# EAGLE design HighVoltageMeasurementModule_1000V_multi (EAGLE 9.6.2)

## Sheet 1 of 2
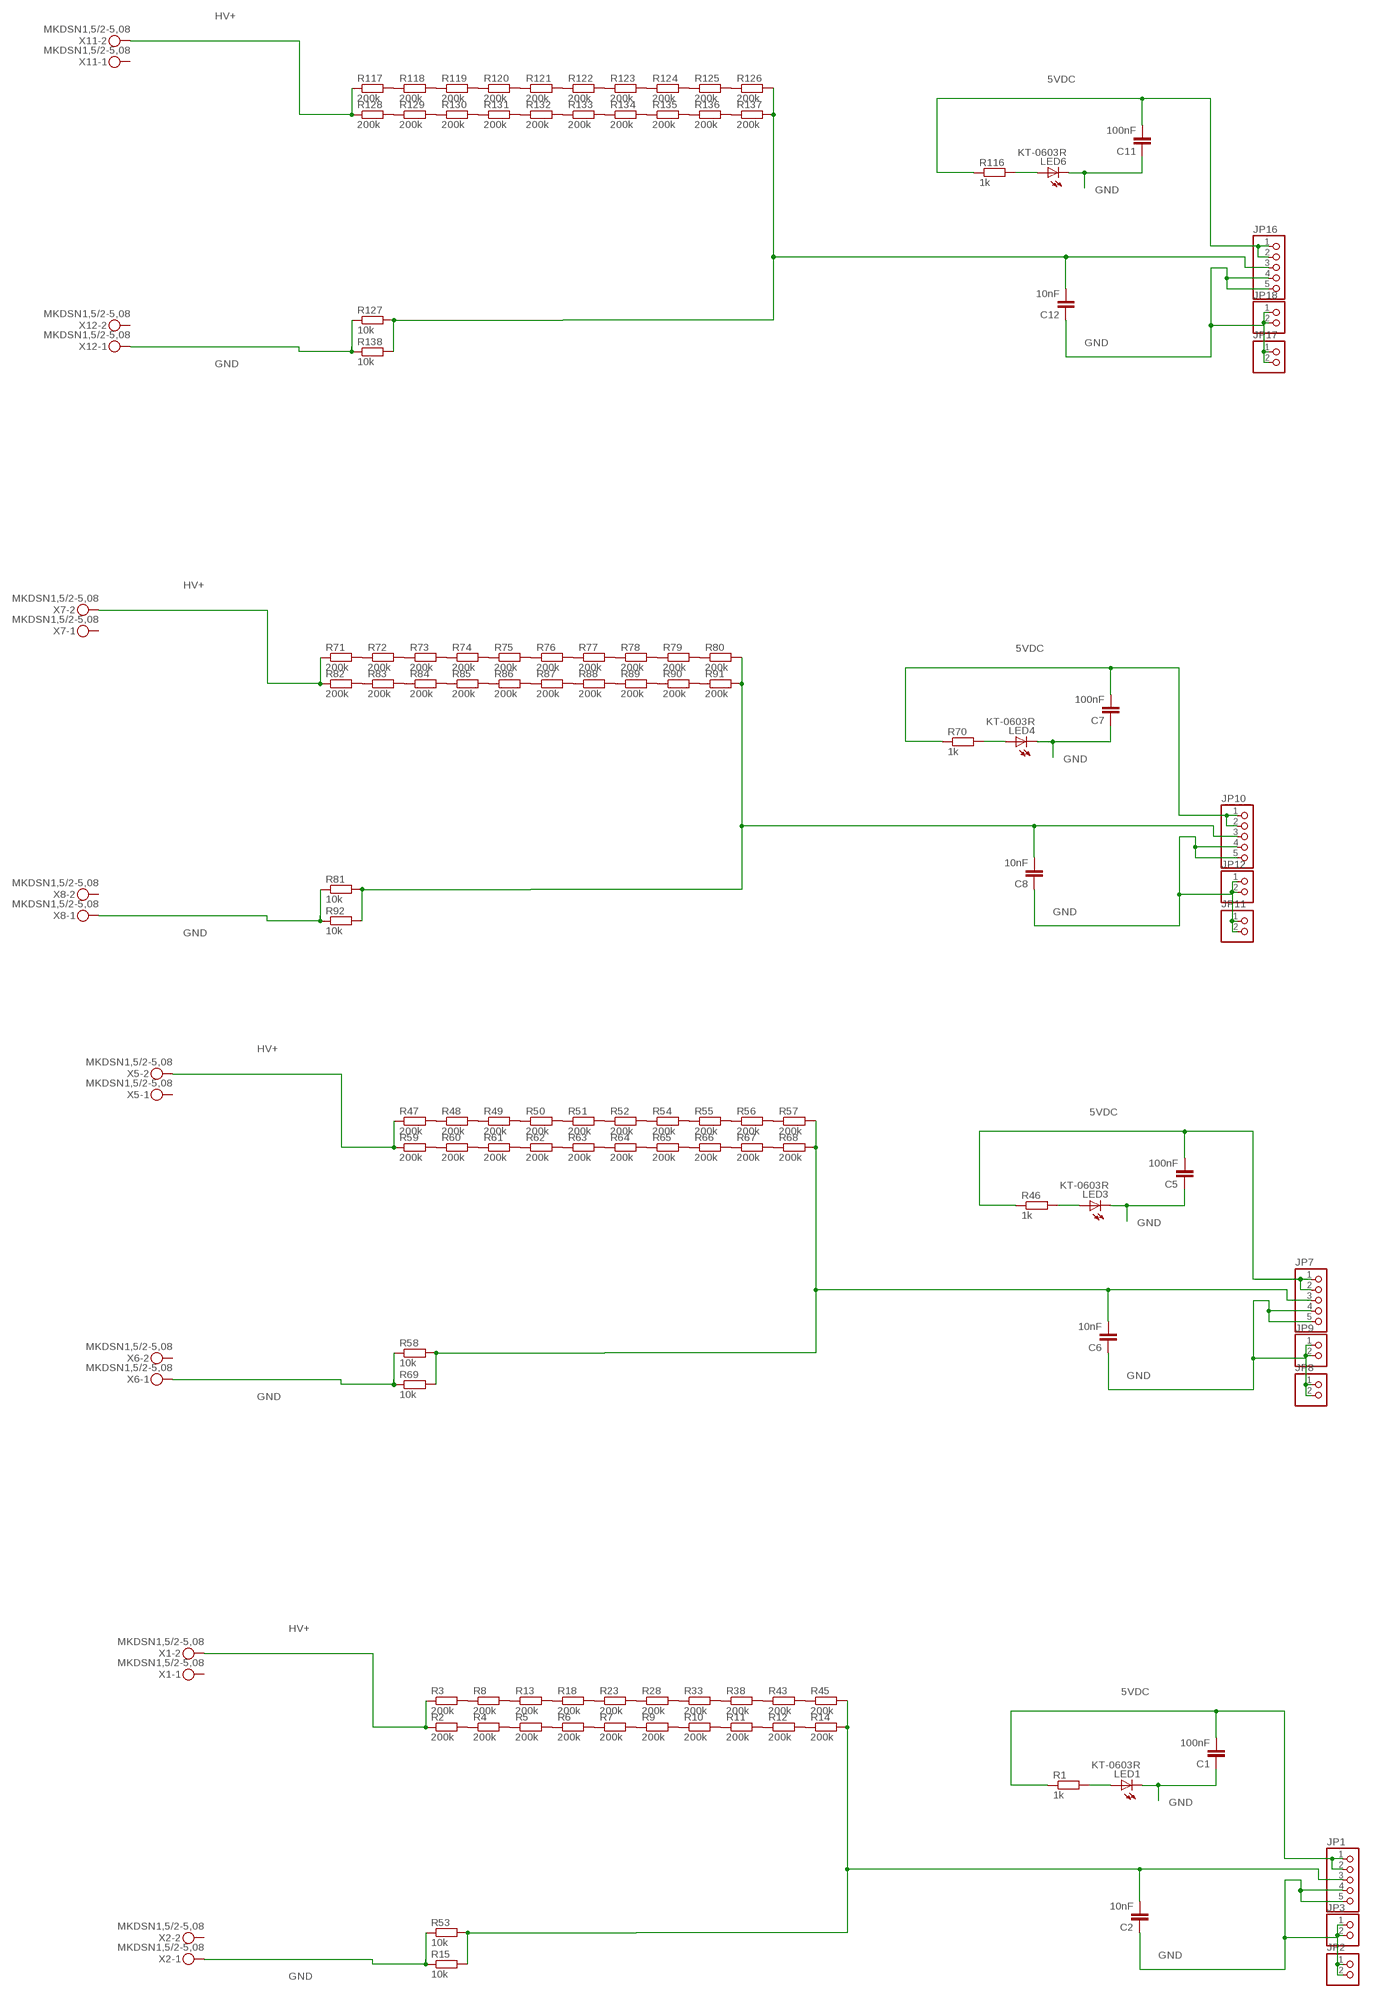
[diagram p0: schematic, sheet 1, part 1 of 2]
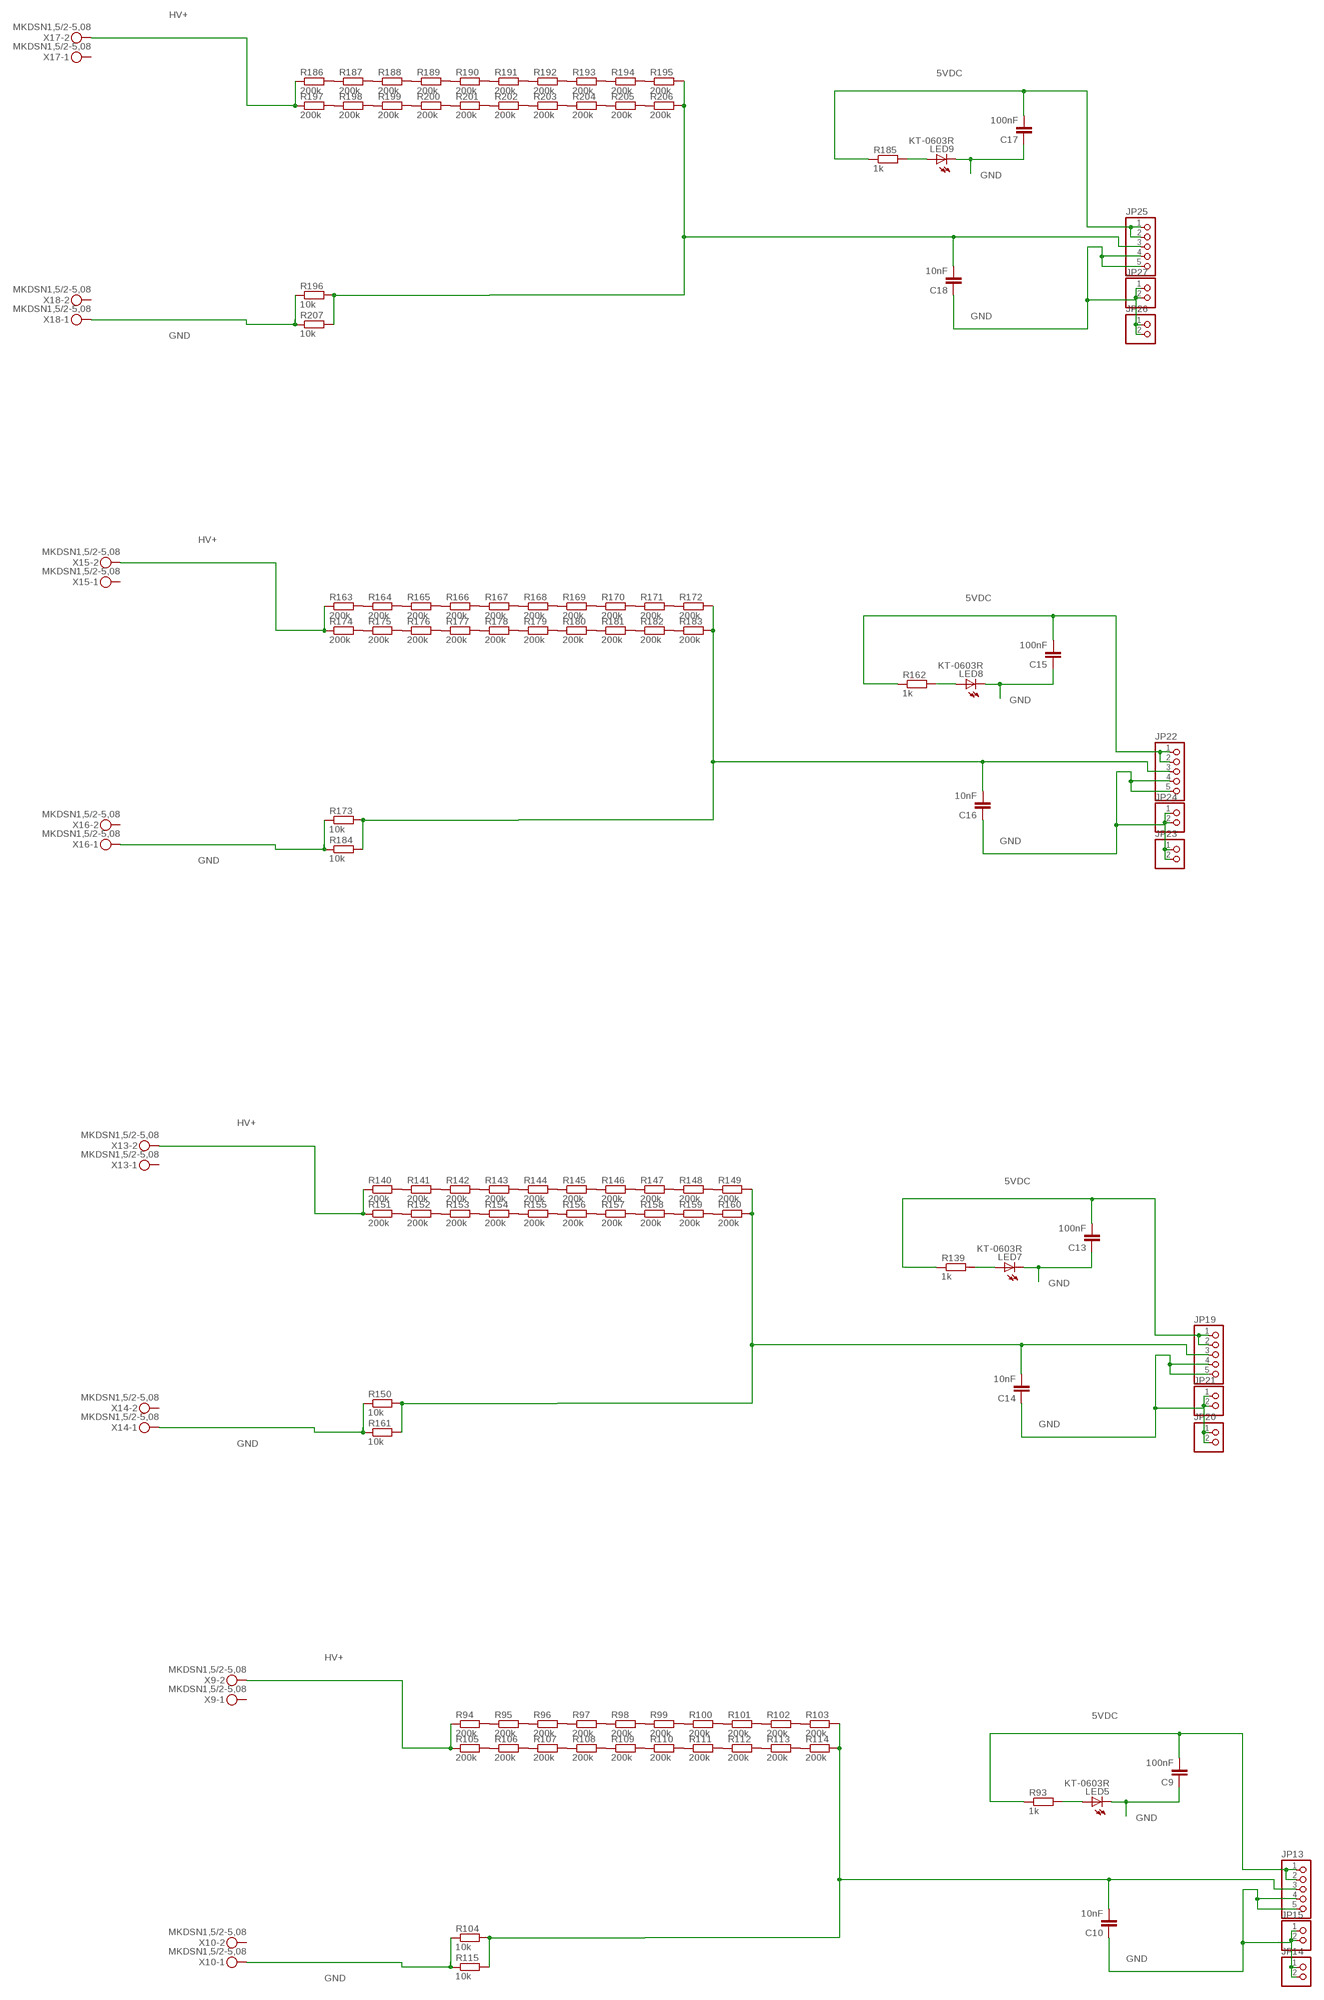
[diagram p1: schematic, sheet 1, part 2 of 2]

### Parts
C1  100nF  C-EUC0805  [C0805]
C2  10nF  C-EUC0805  [C0805]
C5  100nF  C-EUC0805  [C0805]
C6  10nF  C-EUC0805  [C0805]
C7  100nF  C-EUC0805  [C0805]
C8  10nF  C-EUC0805  [C0805]
C9  100nF  C-EUC0805  [C0805]
C10  10nF  C-EUC0805  [C0805]
C11  100nF  C-EUC0805  [C0805]
C12  10nF  C-EUC0805  [C0805]
C13  100nF  C-EUC0805  [C0805]
C14  10nF  C-EUC0805  [C0805]
C15  100nF  C-EUC0805  [C0805]
C16  10nF  C-EUC0805  [C0805]
C17  100nF  C-EUC0805  [C0805]
C18  10nF  C-EUC0805  [C0805]
JP1  PINHD-1X5  [1X05]
JP2  PINHD-1X2  [1X02]
JP3  PINHD-1X2  [1X02]
JP7  PINHD-1X5  [1X05]
JP8  PINHD-1X2  [1X02]
JP9  PINHD-1X2  [1X02]
JP10  PINHD-1X5  [1X05]
JP11  PINHD-1X2  [1X02]
JP12  PINHD-1X2  [1X02]
JP13  PINHD-1X5  [1X05]
JP14  PINHD-1X2  [1X02]
JP15  PINHD-1X2  [1X02]
JP16  PINHD-1X5  [1X05]
JP17  PINHD-1X2  [1X02]
JP18  PINHD-1X2  [1X02]
JP19  PINHD-1X5  [1X05]
JP20  PINHD-1X2  [1X02]
JP21  PINHD-1X2  [1X02]
JP22  PINHD-1X5  [1X05]
JP23  PINHD-1X2  [1X02]
JP24  PINHD-1X2  [1X02]
JP25  PINHD-1X5  [1X05]
JP26  PINHD-1X2  [1X02]
JP27  PINHD-1X2  [1X02]
LED1  KT-0603R  LEDCHIPLED_0603  [CHIPLED_0603]
LED3  KT-0603R  LEDCHIPLED_0603  [CHIPLED_0603]
LED4  KT-0603R  LEDCHIPLED_0603  [CHIPLED_0603]
LED5  KT-0603R  LEDCHIPLED_0603  [CHIPLED_0603]
LED6  KT-0603R  LEDCHIPLED_0603  [CHIPLED_0603]
LED7  KT-0603R  LEDCHIPLED_0603  [CHIPLED_0603]
LED8  KT-0603R  LEDCHIPLED_0603  [CHIPLED_0603]
LED9  KT-0603R  LEDCHIPLED_0603  [CHIPLED_0603]
R1  1k  R-EU_R0805  [R0805]
R2  200k  R-EU_R0805  [R0805]
R3  200k  R-EU_R0805  [R0805]
R4  200k  R-EU_R0805  [R0805]
R5  200k  R-EU_R0805  [R0805]
R6  200k  R-EU_R0805  [R0805]
R7  200k  R-EU_R0805  [R0805]
R8  200k  R-EU_R0805  [R0805]
R9  200k  R-EU_R0805  [R0805]
R10  200k  R-EU_R0805  [R0805]
R11  200k  R-EU_R0805  [R0805]
R12  200k  R-EU_R0805  [R0805]
R13  200k  R-EU_R0805  [R0805]
R14  200k  R-EU_R0805  [R0805]
R15  10k  R-EU_R0805  [R0805]
R18  200k  R-EU_R0805  [R0805]
R23  200k  R-EU_R0805  [R0805]
R28  200k  R-EU_R0805  [R0805]
R33  200k  R-EU_R0805  [R0805]
R38  200k  R-EU_R0805  [R0805]
R43  200k  R-EU_R0805  [R0805]
R45  200k  R-EU_R0805  [R0805]
R46  1k  R-EU_R0805  [R0805]
R47  200k  R-EU_R0805  [R0805]
R48  200k  R-EU_R0805  [R0805]
R49  200k  R-EU_R0805  [R0805]
R50  200k  R-EU_R0805  [R0805]
R51  200k  R-EU_R0805  [R0805]
R52  200k  R-EU_R0805  [R0805]
R53  10k  R-EU_R0805  [R0805]
R54  200k  R-EU_R0805  [R0805]
R55  200k  R-EU_R0805  [R0805]
R56  200k  R-EU_R0805  [R0805]
R57  200k  R-EU_R0805  [R0805]
R58  10k  R-EU_R0805  [R0805]
R59  200k  R-EU_R0805  [R0805]
R60  200k  R-EU_R0805  [R0805]
R61  200k  R-EU_R0805  [R0805]
R62  200k  R-EU_R0805  [R0805]
R63  200k  R-EU_R0805  [R0805]
R64  200k  R-EU_R0805  [R0805]
R65  200k  R-EU_R0805  [R0805]
R66  200k  R-EU_R0805  [R0805]
R67  200k  R-EU_R0805  [R0805]
R68  200k  R-EU_R0805  [R0805]
R69  10k  R-EU_R0805  [R0805]
R70  1k  R-EU_R0805  [R0805]
R71  200k  R-EU_R0805  [R0805]
R72  200k  R-EU_R0805  [R0805]
R73  200k  R-EU_R0805  [R0805]
R74  200k  R-EU_R0805  [R0805]
R75  200k  R-EU_R0805  [R0805]
R76  200k  R-EU_R0805  [R0805]
R77  200k  R-EU_R0805  [R0805]
R78  200k  R-EU_R0805  [R0805]
R79  200k  R-EU_R0805  [R0805]
R80  200k  R-EU_R0805  [R0805]
R81  10k  R-EU_R0805  [R0805]
R82  200k  R-EU_R0805  [R0805]
R83  200k  R-EU_R0805  [R0805]
R84  200k  R-EU_R0805  [R0805]
R85  200k  R-EU_R0805  [R0805]
R86  200k  R-EU_R0805  [R0805]
R87  200k  R-EU_R0805  [R0805]
R88  200k  R-EU_R0805  [R0805]
R89  200k  R-EU_R0805  [R0805]
R90  200k  R-EU_R0805  [R0805]
R91  200k  R-EU_R0805  [R0805]
R92  10k  R-EU_R0805  [R0805]
R93  1k  R-EU_R0805  [R0805]
R94  200k  R-EU_R0805  [R0805]
R95  200k  R-EU_R0805  [R0805]
R96  200k  R-EU_R0805  [R0805]
R97  200k  R-EU_R0805  [R0805]
R98  200k  R-EU_R0805  [R0805]
R99  200k  R-EU_R0805  [R0805]
R100  200k  R-EU_R0805  [R0805]
R101  200k  R-EU_R0805  [R0805]
R102  200k  R-EU_R0805  [R0805]
R103  200k  R-EU_R0805  [R0805]
R104  10k  R-EU_R0805  [R0805]
R105  200k  R-EU_R0805  [R0805]
R106  200k  R-EU_R0805  [R0805]
R107  200k  R-EU_R0805  [R0805]
R108  200k  R-EU_R0805  [R0805]
R109  200k  R-EU_R0805  [R0805]
R110  200k  R-EU_R0805  [R0805]
R111  200k  R-EU_R0805  [R0805]
R112  200k  R-EU_R0805  [R0805]
R113  200k  R-EU_R0805  [R0805]
R114  200k  R-EU_R0805  [R0805]
R115  10k  R-EU_R0805  [R0805]
R116  1k  R-EU_R0805  [R0805]
R117  200k  R-EU_R0805  [R0805]
R118  200k  R-EU_R0805  [R0805]
R119  200k  R-EU_R0805  [R0805]
R120  200k  R-EU_R0805  [R0805]
R121  200k  R-EU_R0805  [R0805]
R122  200k  R-EU_R0805  [R0805]
R123  200k  R-EU_R0805  [R0805]
R124  200k  R-EU_R0805  [R0805]
R125  200k  R-EU_R0805  [R0805]
R126  200k  R-EU_R0805  [R0805]
R127  10k  R-EU_R0805  [R0805]
R128  200k  R-EU_R0805  [R0805]
R129  200k  R-EU_R0805  [R0805]
R130  200k  R-EU_R0805  [R0805]
R131  200k  R-EU_R0805  [R0805]
R132  200k  R-EU_R0805  [R0805]
R133  200k  R-EU_R0805  [R0805]
R134  200k  R-EU_R0805  [R0805]
R135  200k  R-EU_R0805  [R0805]
R136  200k  R-EU_R0805  [R0805]
R137  200k  R-EU_R0805  [R0805]
R138  10k  R-EU_R0805  [R0805]
R139  1k  R-EU_R0805  [R0805]
R140  200k  R-EU_R0805  [R0805]
R141  200k  R-EU_R0805  [R0805]
R142  200k  R-EU_R0805  [R0805]
R143  200k  R-EU_R0805  [R0805]
R144  200k  R-EU_R0805  [R0805]
R145  200k  R-EU_R0805  [R0805]
R146  200k  R-EU_R0805  [R0805]
R147  200k  R-EU_R0805  [R0805]
R148  200k  R-EU_R0805  [R0805]
R149  200k  R-EU_R0805  [R0805]
R150  10k  R-EU_R0805  [R0805]
R151  200k  R-EU_R0805  [R0805]
R152  200k  R-EU_R0805  [R0805]
R153  200k  R-EU_R0805  [R0805]
R154  200k  R-EU_R0805  [R0805]
R155  200k  R-EU_R0805  [R0805]
R156  200k  R-EU_R0805  [R0805]
R157  200k  R-EU_R0805  [R0805]
R158  200k  R-EU_R0805  [R0805]
R159  200k  R-EU_R0805  [R0805]
R160  200k  R-EU_R0805  [R0805]
R161  10k  R-EU_R0805  [R0805]
R162  1k  R-EU_R0805  [R0805]
R163  200k  R-EU_R0805  [R0805]
R164  200k  R-EU_R0805  [R0805]
R165  200k  R-EU_R0805  [R0805]
R166  200k  R-EU_R0805  [R0805]
R167  200k  R-EU_R0805  [R0805]
R168  200k  R-EU_R0805  [R0805]
R169  200k  R-EU_R0805  [R0805]
R170  200k  R-EU_R0805  [R0805]
R171  200k  R-EU_R0805  [R0805]
R172  200k  R-EU_R0805  [R0805]
R173  10k  R-EU_R0805  [R0805]
R174  200k  R-EU_R0805  [R0805]
R175  200k  R-EU_R0805  [R0805]
R176  200k  R-EU_R0805  [R0805]
R177  200k  R-EU_R0805  [R0805]
R178  200k  R-EU_R0805  [R0805]
R179  200k  R-EU_R0805  [R0805]
R180  200k  R-EU_R0805  [R0805]
R181  200k  R-EU_R0805  [R0805]
R182  200k  R-EU_R0805  [R0805]
R183  200k  R-EU_R0805  [R0805]
R184  10k  R-EU_R0805  [R0805]
R185  1k  R-EU_R0805  [R0805]
R186  200k  R-EU_R0805  [R0805]
R187  200k  R-EU_R0805  [R0805]
R188  200k  R-EU_R0805  [R0805]
R189  200k  R-EU_R0805  [R0805]
R190  200k  R-EU_R0805  [R0805]
R191  200k  R-EU_R0805  [R0805]
R192  200k  R-EU_R0805  [R0805]
R193  200k  R-EU_R0805  [R0805]
R194  200k  R-EU_R0805  [R0805]
R195  200k  R-EU_R0805  [R0805]
R196  10k  R-EU_R0805  [R0805]
R197  200k  R-EU_R0805  [R0805]
R198  200k  R-EU_R0805  [R0805]
R199  200k  R-EU_R0805  [R0805]
R200  200k  R-EU_R0805  [R0805]
R201  200k  R-EU_R0805  [R0805]
R202  200k  R-EU_R0805  [R0805]
R203  200k  R-EU_R0805  [R0805]
R204  200k  R-EU_R0805  [R0805]
R205  200k  R-EU_R0805  [R0805]
R206  200k  R-EU_R0805  [R0805]
R207  10k  R-EU_R0805  [R0805]
X1  MKDSN1,5/2-5,08  [MKDSN1,5/2-5,08]
X2  MKDSN1,5/2-5,08  [MKDSN1,5/2-5,08]
X5  MKDSN1,5/2-5,08  [MKDSN1,5/2-5,08]
X6  MKDSN1,5/2-5,08  [MKDSN1,5/2-5,08]
X7  MKDSN1,5/2-5,08  [MKDSN1,5/2-5,08]
X8  MKDSN1,5/2-5,08  [MKDSN1,5/2-5,08]
X9  MKDSN1,5/2-5,08  [MKDSN1,5/2-5,08]
X10  MKDSN1,5/2-5,08  [MKDSN1,5/2-5,08]
X11  MKDSN1,5/2-5,08  [MKDSN1,5/2-5,08]
X12  MKDSN1,5/2-5,08  [MKDSN1,5/2-5,08]
X13  MKDSN1,5/2-5,08  [MKDSN1,5/2-5,08]
X14  MKDSN1,5/2-5,08  [MKDSN1,5/2-5,08]
X15  MKDSN1,5/2-5,08  [MKDSN1,5/2-5,08]
X16  MKDSN1,5/2-5,08  [MKDSN1,5/2-5,08]
X17  MKDSN1,5/2-5,08  [MKDSN1,5/2-5,08]
X18  MKDSN1,5/2-5,08  [MKDSN1,5/2-5,08]

### Nets
5VDC: C1.2 C5.2 C7.2 C9.2 C11.2 C13.2 C15.2 C17.2 JP1.1 JP1.2 JP7.1 JP7.2 JP10.1 JP10.2 JP13.1 JP13.2 JP16.1 JP16.2 JP19.1 JP19.2 JP22.1 JP22.2 JP25.1 JP25.2 R1.1 R46.1 R70.1 R93.1 R116.1 R139.1 R162.1 R185.1
GND: C1.1 C2.1 C5.1 C6.1 C7.1 C8.1 C9.1 C10.1 C11.1 C12.1 C13.1 C14.1 C15.1 C16.1 C17.1 C18.1 JP1.4 JP1.5 JP2.1 JP2.2 JP3.1 JP3.2 JP7.4 JP7.5 JP8.1 JP8.2 JP9.1 JP9.2 JP10.4 JP10.5 JP11.1 JP11.2 JP12.1 JP12.2 JP13.4 JP13.5 JP14.1 JP14.2 JP15.1 JP15.2 JP16.4 JP16.5 JP17.1 JP17.2 JP18.1 JP18.2 JP19.4 JP19.5 JP20.1 JP20.2 JP21.1 JP21.2 JP22.4 JP22.5 JP23.1 JP23.2 JP24.1 JP24.2 JP25.4 JP25.5 JP26.1 JP26.2 JP27.1 JP27.2 LED1.C LED3.C LED4.C LED5.C LED6.C LED7.C LED8.C LED9.C R15.1 R53.1 R58.1 R69.1 R81.1 R92.1 R104.1 R115.1 R127.1 R138.1 R150.1 R161.1 R173.1 R184.1 R196.1 R207.1 X2.1 X6.1 X8.1 X10.1 X12.1 X14.1 X16.1 X18.1
HV+: R2.1 R3.1 R47.1 R59.1 R71.1 R82.1 R94.1 R105.1 R117.1 R128.1 R140.1 R151.1 R163.1 R174.1 R186.1 R197.1 X1.2 X5.2 X7.2 X9.2 X11.2 X13.2 X15.2 X17.2
N$1: R2.2 R4.1
N$2: R4.2 R5.1
N$3: R5.2 R6.1
N$4: R6.2 R7.1
N$5: LED1.A R1.2
N$7: R7.2 R9.1
N$8: R3.2 R8.1
N$9: R8.2 R13.1
N$10: R9.2 R10.1
N$11: R10.2 R11.1
N$12: R11.2 R12.1
N$13: R12.2 R14.1
N$14: R13.2 R18.1
N$15: C2.2 JP1.3 R14.2 R15.2 R45.2 R53.2
N$19: R18.2 R23.1
N$24: R23.2 R28.1
N$29: R28.2 R33.1
N$34: R33.2 R38.1
N$39: R38.2 R43.1
N$40: LED3.A R46.2
N$41: R43.2 R45.1
N$42: R47.2 R48.1
N$43: R48.2 R49.1
N$44: R49.2 R50.1
N$45: R50.2 R51.1
N$46: R51.2 R52.1
N$47: R52.2 R54.1
N$48: R54.2 R55.1
N$49: R55.2 R56.1
N$50: R56.2 R57.1
N$51: R59.2 R60.1
N$52: R60.2 R61.1
N$53: R61.2 R62.1
N$54: R62.2 R63.1
N$55: R63.2 R64.1
N$56: R64.2 R65.1
N$57: R65.2 R66.1
N$58: R66.2 R67.1
N$59: R67.2 R68.1
N$60: C6.2 JP7.3 R57.2 R58.2 R68.2 R69.2
N$61: LED4.A R70.2
N$62: R71.2 R72.1
N$63: R72.2 R73.1
N$64: R73.2 R74.1
N$65: R74.2 R75.1
N$66: R75.2 R76.1
N$67: R76.2 R77.1
N$68: R77.2 R78.1
N$69: R78.2 R79.1
N$70: R79.2 R80.1
N$71: R82.2 R83.1
N$72: R83.2 R84.1
N$73: R84.2 R85.1
N$74: R85.2 R86.1
N$75: R86.2 R87.1
N$76: R87.2 R88.1
N$77: R88.2 R89.1
N$78: R89.2 R90.1
N$79: R90.2 R91.1
N$80: C8.2 JP10.3 R80.2 R81.2 R91.2 R92.2
N$81: LED5.A R93.2
N$82: R94.2 R95.1
N$83: R95.2 R96.1
N$84: R96.2 R97.1
N$85: R97.2 R98.1
N$86: R98.2 R99.1
N$87: R99.2 R100.1
N$88: R100.2 R101.1
N$89: R101.2 R102.1
N$90: R102.2 R103.1
N$91: R105.2 R106.1
N$92: R106.2 R107.1
N$93: R107.2 R108.1
N$94: R108.2 R109.1
N$95: R109.2 R110.1
N$96: R110.2 R111.1
N$97: R111.2 R112.1
N$98: R112.2 R113.1
N$99: R113.2 R114.1
N$100: C10.2 JP13.3 R103.2 R104.2 R114.2 R115.2
N$101: LED6.A R116.2
N$102: R117.2 R118.1
N$103: R118.2 R119.1
N$104: R119.2 R120.1
N$105: R120.2 R121.1
N$106: R121.2 R122.1
N$107: R122.2 R123.1
N$108: R123.2 R124.1
N$109: R124.2 R125.1
N$110: R125.2 R126.1
N$111: R128.2 R129.1
N$112: R129.2 R130.1
N$113: R130.2 R131.1
N$114: R131.2 R132.1
N$115: R132.2 R133.1
N$116: R133.2 R134.1
N$117: R134.2 R135.1
N$118: R135.2 R136.1
N$119: R136.2 R137.1
N$120: C12.2 JP16.3 R126.2 R127.2 R137.2 R138.2
N$121: LED7.A R139.2
N$122: R140.2 R141.1
N$123: R141.2 R142.1
N$124: R142.2 R143.1
N$125: R143.2 R144.1
N$126: R144.2 R145.1
N$127: R145.2 R146.1
N$128: R146.2 R147.1
N$129: R147.2 R148.1
N$130: R148.2 R149.1
N$131: R151.2 R152.1
N$132: R152.2 R153.1
N$133: R153.2 R154.1
N$134: R154.2 R155.1
N$135: R155.2 R156.1
N$136: R156.2 R157.1
N$137: R157.2 R158.1
N$138: R158.2 R159.1
N$139: R159.2 R160.1
N$140: C14.2 JP19.3 R149.2 R150.2 R160.2 R161.2
N$141: LED8.A R162.2
N$142: R163.2 R164.1
N$143: R164.2 R165.1
N$144: R165.2 R166.1
N$145: R166.2 R167.1
N$146: R167.2 R168.1
N$147: R168.2 R169.1
N$148: R169.2 R170.1
N$149: R170.2 R171.1
N$150: R171.2 R172.1
N$151: R174.2 R175.1
N$152: R175.2 R176.1
N$153: R176.2 R177.1
N$154: R177.2 R178.1
N$155: R178.2 R179.1
N$156: R179.2 R180.1
N$157: R180.2 R181.1
N$158: R181.2 R182.1
N$159: R182.2 R183.1
N$160: C16.2 JP22.3 R172.2 R173.2 R183.2 R184.2
N$161: LED9.A R185.2
N$162: R186.2 R187.1
N$163: R187.2 R188.1
N$164: R188.2 R189.1
N$165: R189.2 R190.1
N$166: R190.2 R191.1
N$167: R191.2 R192.1
N$168: R192.2 R193.1
N$169: R193.2 R194.1
N$170: R194.2 R195.1
N$171: R197.2 R198.1
N$172: R198.2 R199.1
N$173: R199.2 R200.1
N$174: R200.2 R201.1
N$175: R201.2 R202.1
N$176: R202.2 R203.1
N$177: R203.2 R204.1
N$178: R204.2 R205.1
N$179: R205.2 R206.1
N$180: C18.2 JP25.3 R195.2 R196.2 R206.2 R207.2
Unconnected: X1.1 X2.2 X5.1 X6.2 X7.1 X8.2 X9.1 X10.2 X11.1 X12.2 X13.1 X14.2 X15.1 X16.2 X17.1 X18.2

## Sheet 2 of 2

## Library data of the parts
C1 C2 C5-C18 = rcl:C-EU: CAPACITOR, European symbol
JP1 JP7 JP10 JP13 JP16 JP19 JP22 JP25 = pinhead:PINHD-1X5: PIN HEADER
JP2 JP3 JP8 JP9 JP11 JP12 JP14 JP15 JP17 JP18 JP20 JP21 JP23 JP24 JP26 JP27 = pinhead:PINHD-1X2: PIN HEADER
LED1 LED3-LED9 = led:LED: LED OSRAM: - CHIPLED LG R971, LG N971, LY N971, LG Q971, LY Q971, LO R971, LY R971 LH N974, LH R974 LS Q976, LO Q976, LY Q976 LO Q996 - Hyper CHIPLED LW Q18S LB Q993, LB Q99A, LB R99A - SideLED LS A670, LO A670, LY A670, LG A670, LP A670 LB A673, LV A673, LT A673, LW A673 LH A674 LY A675 LS A676, LA A676, LO A676, LY A676, LW A676 LS A679, LY A679, LG A679 - Hyper Micro SIDELED® LS Y876, LA Y876, LO Y876, LY Y876 LT Y87S - SmartLED LW L88C, LW L88S LB L89C, LB L89S, LG L890 LS L89K, LO L89K, LY L89K LS L896, LA L896, LO L896, LY L896 - TOPLED LS T670, LO T670, LY T670, LG T670, LP T670 LSG T670, LSP T670, LSY T670, LOP T670, LYG T670 LG T671, LOG T671, LSG T671 LB T673, LV T673, LT T673, LW T673 LH T674 LS T676, LA T676, LO T676, LY T676, LB T676, LH T676, LSB T676, LW T676 LB T67C, LV T67C, LT T67C, LS T67K, LO T67K, LY T67K, LW E67C LS E67B, LA E67B, LO E67B, LY E67B, LB E67C, LV E67C, LT E67C LW T67C LS T679, LY T679, LG T679 LS T770, LO T770, LY T770, LG T770, LP T770 LB T773, LV T773, LT T773, LW T773 LH T774 LS E675, LA E675, LY E675, LS T675 LS T776, LA T776, LO T776, LY T776, LB T776 LHGB T686 LT T68C, LB T68C - Hyper Mini TOPLED® LB M676 - Mini TOPLED Santana® LG M470 LS M47K, LO M47K, LY M47K Source: http://www.osram.convergy.de LUXEON: - LUMILED® LXK2-PW12-R00, LXK2-PW12-S00, LXK2-PW14-U00, LXK2-PW14-V00 LXK2-PM12-R00, LXK2-PM12-S00, LXK2-PM14-U00 LXK2-PE12-Q00, LXK2-PE12-R00, LXK2-PE12-S00, LXK2-PE14-T00, LXK2-PE14-U00 LXK2-PB12-K00, LXK2-PB12-L00, LXK2-PB12-M00, LXK2-PB14-N00, LXK2-PB14-P00, LXK2-PB14-Q00 LXK2-PR12-L00, LXK2-PR12-M00, LXK2-PR14-Q00, LXK2-PR14-R00 LXK2-PD12-Q00, LXK2-PD12-R00, LXK2-PD12-S00 LXK2-PH12-R00, LXK2-PH12-S00 LXK2-PL12-P00, LXK2-PL12-Q00, LXK2-PL12-R00 Source: www.luxeon.com KINGBRIGHT: KA-3528ASYC Source: www.kingbright.com
R1-R15 R18 R23 R28 R33 R38 R43 R45-R207 = rcl:R-EU_: RESISTOR, European symbol
X1 X2 X5-X18 = con-phoenix-508:MKDSN1,5/2-5,08: MKDSN 1,5/ 2-5,08 Printklemme Nennstrom: 13,5 A Nennspannung: 250 V Rastermaß: 5,08 mm Polzahl: 2 Anschlussart: Schraubanschluss Montage: Löten Anschlussrichtung Leiter/Platine: 0 ° Artikelnummer: 1729128 Source: http://eshop.phoenixcontact.com .. 1729128.pdf

## Board
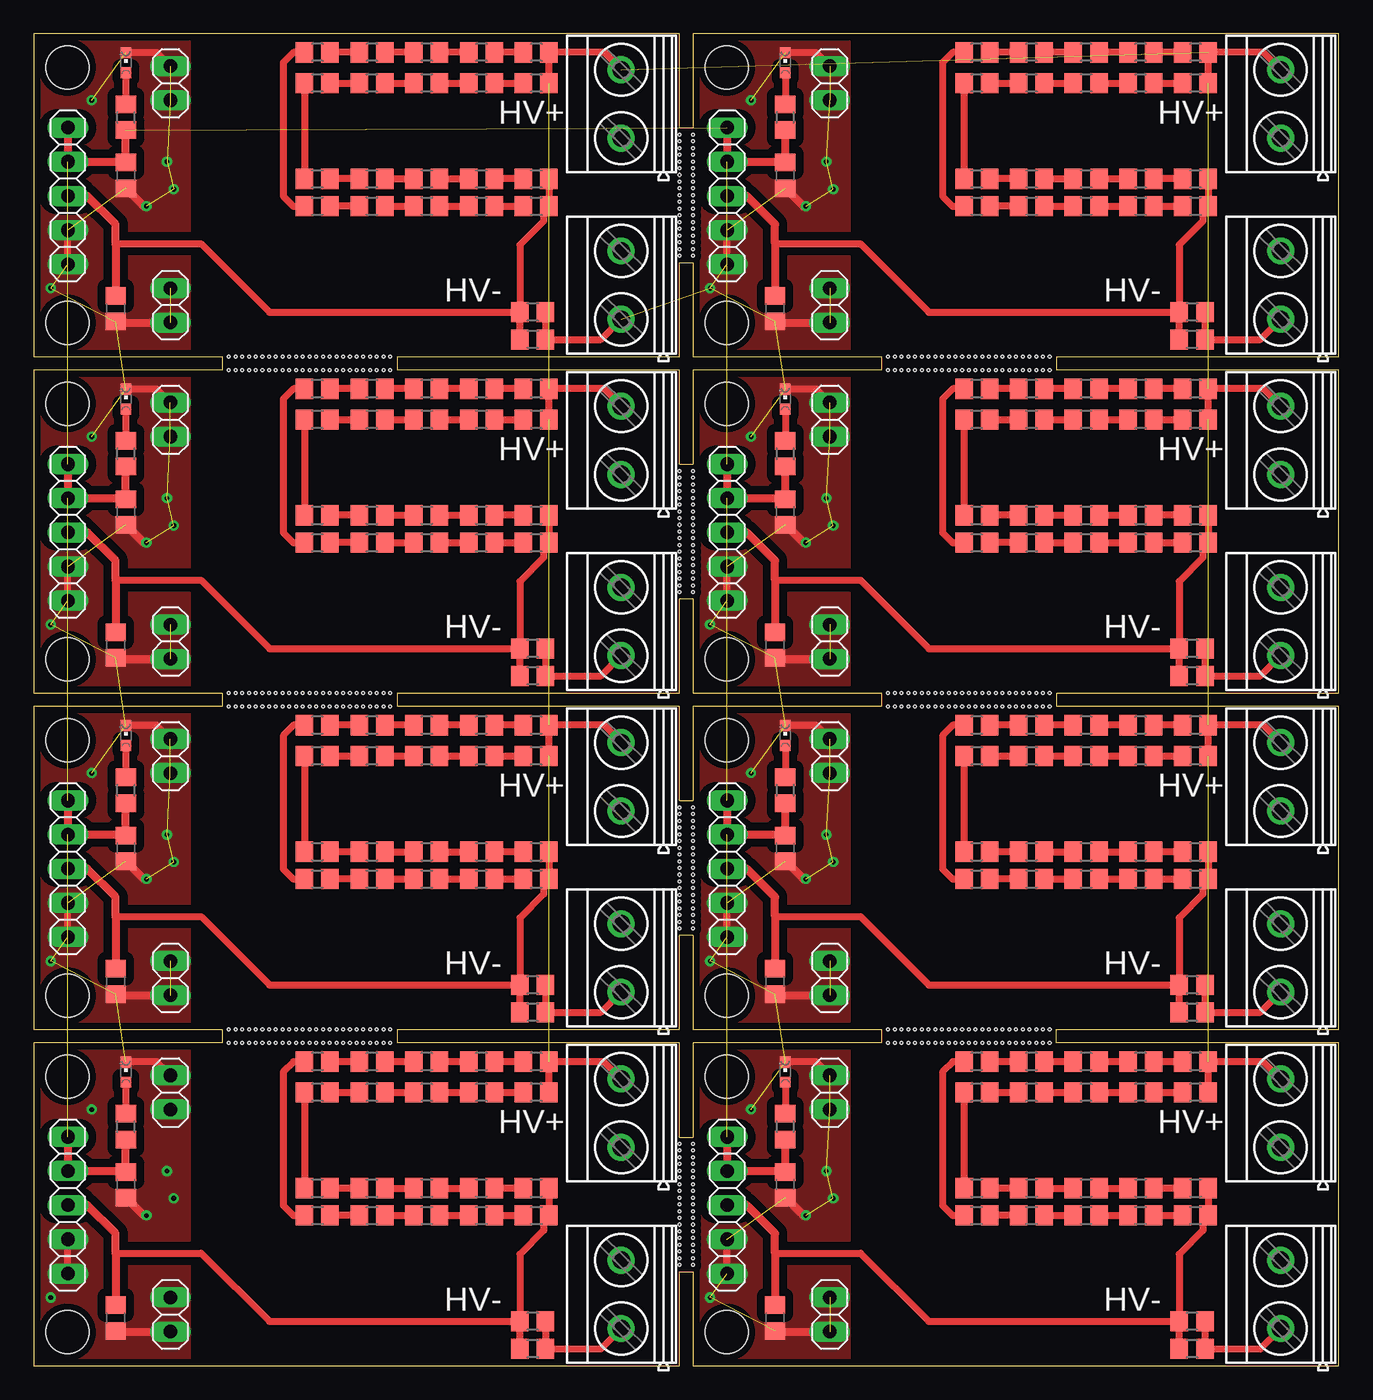
[diagram p2: board, top side]
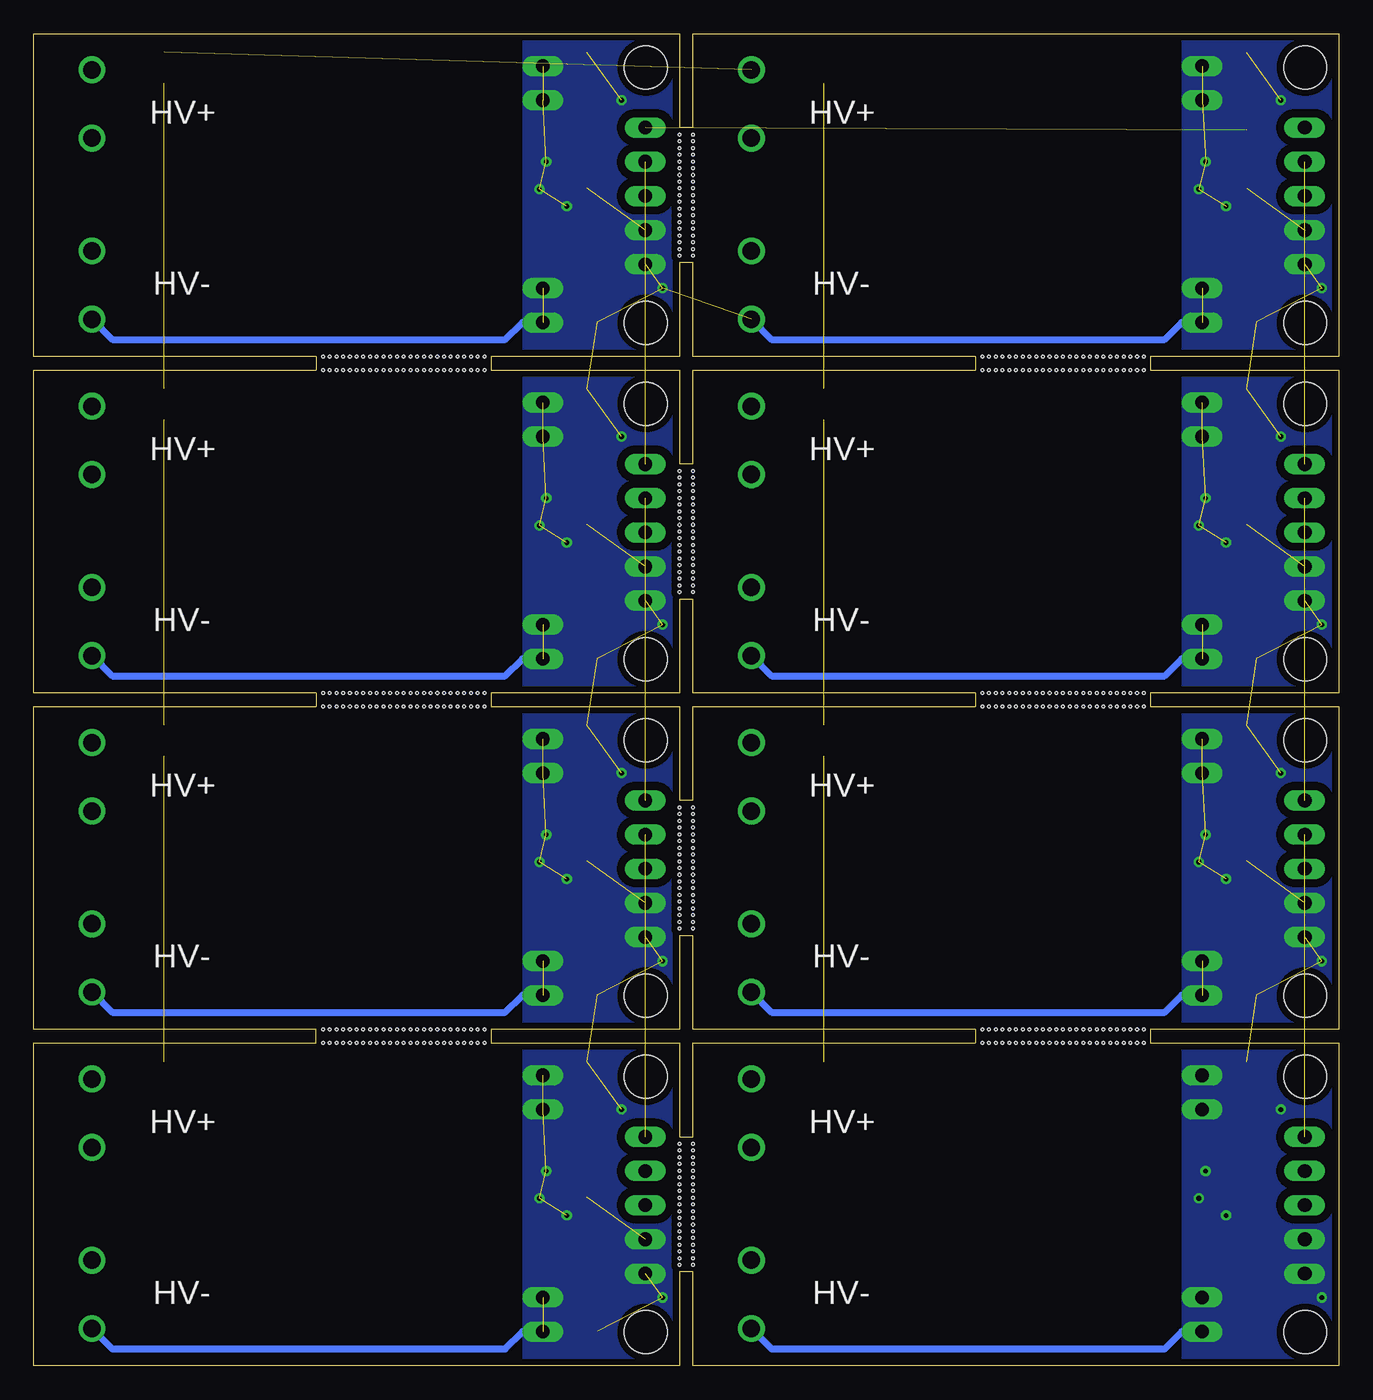
[diagram p3: board, bottom side, seen from below]

Size 97 x 99 mm. Coordinates in mm from the lower left corner, seen from the top.
Outline: 0,0 48,0 48,7 49,7 49,0 97,0 97,24 76,24 76,25 97,25 97,49 76,49 76,50 97,50 97,74 76,74 76,75 97,75 97,99 49,99 49,92 48,92 48,99 0,99 0,75 14,75 14,74 0,74 0,50 14,50 14,49 0,49 0,25 14,25 14,24 0,24 0,0
Outline: 48,17 48,24 27,24 27,25 48,25 48,32 49,32 49,25 63,25 63,24 49,24 49,17 48,17
Outline: 48,42 48,49 27,49 27,50 48,50 48,57 49,57 49,50 63,50 63,49 49,49 49,42 48,42
Outline: 48,67 48,74 27,74 27,75 48,75 48,82 49,82 49,75 63,75 63,74 49,74 49,67 48,67
Copper layers (1*16): Top 0.035mm / dielectric 1.5mm / Bottom 0.035mm
Design rules "default *": minimum track width 6mil, minimum drill 0.35mm, track to track 24mil, track to pad 24mil, pad to pad 6mil, via to via 6mil, smd to smd 6mil, copper to edge 20mil, drill to drill 6mil, minimum pad ring 10mil, minimum via ring 8mil, stop-mask expansion 4mil, vias tented up to drill 0mil, thermal gap 10mil
Holes 3.2 mm at 2.5,21.5 2.5,2.5 51.5,21.5 51.5,2.5 2.5,46.5 2.5,27.5 51.5,46.5 51.5,27.5 2.5,71.5 2.5,52.5 51.5,71.5 51.5,52.5 2.5,96.5 2.5,77.5 51.5,96.5 51.5,77.5
Holes 0.2 mm at 14.5,75 14.5,74 15,74 15.5,74 16,74 16.5,74 17.5,74 17,74 18,74 18.5,74 19,74 19.5,74 20,74 20.5,74 21,74 21.5,74 22,74 23,74 22.5,74 23.5,74 24,74 24.5,74 25.5,74 26,74 25,74 26.5,74 26.5,75 26,75 25.5,75 25,75 24.5,75 24,75 23.5,75 23,75 22.5,75 22,75 21.5,75 21,75 20.5,75 20,75 19.5,75 19,75 18.5,75 18,75 17.5,75 17,75 16.5,75 16,75 15.5,75 15,75 63.5,75 63.5,74 64,74 64.5,74 65,74 65.5,74 66.5,74 66,74 67,74 67.5,74 68,74 68.5,74 69,74 69.5,74 70,74 70.5,74 71,74 72,74 71.5,74 72.5,74 73,74 73.5,74 74.5,74 75,74 74,74 75.5,74 75.5,75 75,75 74.5,75 74,75 73.5,75 73,75 72.5,75 72,75 71.5,75 71,75 70.5,75 70,75 69.5,75 69,75 68.5,75 68,75 67.5,75 67,75 66.5,75 66,75 65.5,75 65,75 64.5,75 64,75 63.5,50 63.5,49 64,49 64.5,49 65,49 65.5,49 66.5,49 66,49 67,49 67.5,49 68,49 68.5,49 69,49 69.5,49 70,49 70.5,49 71,49 72,49 71.5,49 72.5,49 73,49 73.5,49 74.5,49 75,49 74,49 75.5,49 75.5,50 75,50 74.5,50 74,50 73.5,50 73,50 72.5,50 72,50 71.5,50 71,50 70.5,50 70,50 69.5,50 69,50 68.5,50 68,50 67.5,50 67,50 66.5,50 66,50 65.5,50 65,50 64.5,50 64,50 14.5,50 14.5,49 15,49 15.5,49 16,49 16.5,49 17.5,49 17,49 18,49 18.5,49 19,49 19.5,49 20,49 20.5,49 21,49 21.5,49 22,49 23,49 22.5,49 23.5,49 24,49 24.5,49 25.5,49 26,49 25,49 26.5,49 26.5,50 26,50 25.5,50 25,50 24.5,50 24,50 23.5,50 23,50 22.5,50 22,50 21.5,50 21,50 20.5,50 20,50 19.5,50 19,50 18.5,50 18,50 17.5,50 17,50 16.5,50 16,50 15.5,50 15,50 14.5,25 14.5,24 15,24 15.5,24 16,24 16.5,24 17.5,24 17,24 18,24 18.5,24 19,24 19.5,24 20,24 20.5,24 21,24 21.5,24 22,24 23,24 22.5,24 23.5,24 24,24 24.5,24 25.5,24 26,24 25,24 26.5,24 26.5,25 26,25 25.5,25 25,25 24.5,25 24,25 23.5,25 23,25 22.5,25 22,25 21.5,25 21,25 20.5,25 20,25 19.5,25 19,25 18.5,25 18,25 17.5,25 17,25 16.5,25 16,25 15.5,25 15,25 63.5,25 63.5,24 64,24 64.5,24 65,24 65.5,24 66.5,24 66,24 67,24 67.5,24 68,24 68.5,24 69,24 69.5,24 70,24 70.5,24 71,24 72,24 71.5,24 72.5,24 73,24 73.5,24 74.5,24 75,24 74,24 75.5,24 75.5,25 75,25 74.5,25 74,25 73.5,25 73,25 72.5,25 72,25 71.5,25 71,25 70.5,25 70,25 69.5,25 69,25 68.5,25 68,25 67.5,25 67,25 66.5,25 66,25 65.5,25 65,25 64.5,25 64,25 48,7.5 49,7.5 49,8 48,8 48,8.5 49,8.5 49,9 48,9 48,9.5 49,9.5 49,10 49,10.5 49,11 49,11.5 49,12 49,12.5 49,13 49,13.5 49,14 49,15 49,14.5 49,15.5 49,16 49,16.5 48,16.5 48,16 48,15.5 48,15 48,14.5 48,14 48,13.5 48,13 48,12.5 48,12 48,11.5 48,11 48,10.5 48,10 48,32.5 49,32.5 49,33 48,33 48,33.5 49,33.5 49,34 48,34 48,34.5 49,34.5 49,35 49,35.5 49,36 49,36.5 49,37 49,37.5 49,38 49,38.5 49,39 49,40 49,39.5 49,40.5 49,41 49,41.5 48,41.5 48,41 48,40.5 48,40 48,39.5 48,39 48,38.5 48,38 48,37.5 48,37 48,36.5 48,36 48,35.5 48,35 48,57.5 49,57.5 49,58 48,58 48,58.5 49,58.5 49,59 48,59 48,59.5 49,59.5 49,60 49,60.5 49,61 49,61.5 49,62 49,62.5 49,63 49,63.5 49,64 49,65 49,64.5 49,65.5 49,66 49,66.5 48,66.5 48,66 48,65.5 48,65 48,64.5 48,64 48,63.5 48,63 48,62.5 48,62 48,61.5 48,61 48,60.5 48,60 48,82.5 49,82.5 49,83 48,83 48,83.5 49,83.5 49,84 48,84 48,84.5 49,84.5 49,85 49,85.5 49,86 49,86.5 49,87 49,87.5 49,88 49,88.5 49,89 49,90 49,89.5 49,90.5 49,91 49,91.5 48,91.5 48,91 48,90.5 48,90 48,89.5 48,89 48,88.5 48,88 48,87.5 48,87 48,86.5 48,86 48,85.5 48,85

### Footprints (pad centres in the part's own frame; a part is rotated, then mirrored left to right if it is on the bottom)
C0805 = smd 1.3 x 1.5: 1 -0.95,0; 2 0.95,0
1X05 = drill 1.016 long: 1 -5.08,0; 2 -2.54,0; 3 0,0; 4 2.54,0; 5 5.08,0
1X02 = drill 1.016 long: 1 -1.27,0; 2 1.27,0
CHIPLED_0603 = smd 0.8 x 0.8: A 0,-0.75; C 0,0.75
R0805 = smd 1.3 x 1.5: 1 -0.95,0; 2 0.95,0
MKDSN1,5/2-5,08 = drill 1.3 pad 2: 1 -2.561,0.025; 2 2.519,0.025

### Placement (x,y rotation side)
C1  6.86,13.46 90 top
C2  6.1,3.56 90 top
C5  6.86,38.46 90 top
C6  6.1,28.56 90 top
C7  6.86,63.46 90 top
C8  6.1,53.56 90 top
C9  55.86,13.46 90 top
C10  55.1,3.56 90 top
C11  6.86,88.46 90 top
C12  6.1,78.56 90 top
C13  55.86,38.46 90 top
C14  55.1,28.56 90 top
C15  55.86,63.46 90 top
C16  55.1,53.56 90 top
C17  55.86,88.46 90 top
C18  55.1,78.56 90 top
JP1  2.54,11.94 270 top
JP2  10.16,20.32 90 top
JP3  10.16,3.81 270 top
JP7  2.54,36.94 270 top
JP8  10.16,45.32 90 top
JP9  10.16,28.81 270 top
JP10  2.54,61.94 270 top
JP11  10.16,70.32 90 top
JP12  10.16,53.81 270 top
JP13  51.54,11.94 270 top
JP14  59.16,20.32 90 top
JP15  59.16,3.81 270 top
JP16  2.54,86.94 270 top
JP17  10.16,95.32 90 top
JP18  10.16,78.81 270 top
JP19  51.54,36.94 270 top
JP20  59.16,45.32 90 top
JP21  59.16,28.81 270 top
JP22  51.54,61.94 270 top
JP23  59.16,70.32 90 top
JP24  59.16,53.81 270 top
JP25  51.54,86.94 270 top
JP26  59.16,95.32 90 top
JP27  59.16,78.81 270 top
LED1  6.86,21.84 0 top
LED3  6.86,46.84 0 top
LED4  6.86,71.84 0 top
LED5  55.86,21.84 0 top
LED6  6.86,96.84 0 top
LED7  55.86,46.84 0 top
LED8  55.86,71.84 0 top
LED9  55.86,96.84 0 top
R1  6.86,17.78 90 top
R2  37.34,20.32 180 top
R3  37.34,22.61 180 top
R4  33.27,20.32 180 top
R5  29.21,20.32 180 top
R6  25.15,20.32 180 top
R7  21.08,20.32 180 top
R8  33.27,22.61 180 top
R9  21.08,13.21 0 top
R10  25.15,13.21 0 top
R11  29.21,13.21 0 top
R12  33.27,13.21 0 top
R13  29.21,22.61 180 top
R14  37.34,13.21 0 top
R15  37.08,1.27 180 top
R18  25.15,22.61 180 top
R23  21.08,22.61 180 top
R28  21.08,11.18 0 top
R33  25.15,11.18 0 top
R38  29.21,11.18 0 top
R43  33.27,11.18 0 top
R45  37.34,11.18 0 top
R46  6.86,42.78 90 top
R47  37.34,47.61 180 top
R48  33.27,47.61 180 top
R49  29.21,47.61 180 top
R50  25.15,47.61 180 top
R51  21.08,47.61 180 top
R52  21.08,36.18 0 top
R53  37.08,3.3 180 top
R54  25.15,36.18 0 top
R55  29.21,36.18 0 top
R56  33.27,36.18 0 top
R57  37.34,36.18 0 top
R58  37.08,28.3 180 top
R59  37.34,45.32 180 top
R60  33.27,45.32 180 top
R61  29.21,45.32 180 top
R62  25.15,45.32 180 top
R63  21.08,45.32 180 top
R64  21.08,38.21 0 top
R65  25.15,38.21 0 top
R66  29.21,38.21 0 top
R67  33.27,38.21 0 top
R68  37.34,38.21 0 top
R69  37.08,26.27 180 top
R70  6.86,67.78 90 top
R71  37.34,72.61 180 top
R72  33.27,72.61 180 top
R73  29.21,72.61 180 top
R74  25.15,72.61 180 top
R75  21.08,72.61 180 top
R76  21.08,61.18 0 top
R77  25.15,61.18 0 top
R78  29.21,61.18 0 top
R79  33.27,61.18 0 top
R80  37.34,61.18 0 top
R81  37.08,53.3 180 top
R82  37.34,70.32 180 top
R83  33.27,70.32 180 top
R84  29.21,70.32 180 top
R85  25.15,70.32 180 top
R86  21.08,70.32 180 top
R87  21.08,63.21 0 top
R88  25.15,63.21 0 top
R89  29.21,63.21 0 top
R90  33.27,63.21 0 top
R91  37.34,63.21 0 top
R92  37.08,51.27 180 top
R93  55.86,17.78 90 top
R94  86.34,22.61 180 top
R95  82.27,22.61 180 top
R96  78.21,22.61 180 top
R97  74.15,22.61 180 top
R98  70.08,22.61 180 top
R99  70.08,11.18 0 top
R100  74.15,11.18 0 top
R101  78.21,11.18 0 top
R102  82.27,11.18 0 top
R103  86.34,11.18 0 top
R104  86.08,3.3 180 top
R105  86.34,20.32 180 top
R106  82.27,20.32 180 top
R107  78.21,20.32 180 top
R108  74.15,20.32 180 top
R109  70.08,20.32 180 top
R110  70.08,13.21 0 top
R111  74.15,13.21 0 top
R112  78.21,13.21 0 top
R113  82.27,13.21 0 top
R114  86.34,13.21 0 top
R115  86.08,1.27 180 top
R116  6.86,92.78 90 top
R117  37.34,97.61 180 top
R118  33.27,97.61 180 top
R119  29.21,97.61 180 top
R120  25.15,97.61 180 top
R121  21.08,97.61 180 top
R122  21.08,86.18 0 top
R123  25.15,86.18 0 top
R124  29.21,86.18 0 top
R125  33.27,86.18 0 top
R126  37.34,86.18 0 top
R127  37.08,78.3 180 top
R128  37.34,95.32 180 top
R129  33.27,95.32 180 top
R130  29.21,95.32 180 top
R131  25.15,95.32 180 top
R132  21.08,95.32 180 top
R133  21.08,88.21 0 top
R134  25.15,88.21 0 top
R135  29.21,88.21 0 top
R136  33.27,88.21 0 top
R137  37.34,88.21 0 top
R138  37.08,76.27 180 top
R139  55.86,42.78 90 top
R140  86.34,47.61 180 top
R141  82.27,47.61 180 top
R142  78.21,47.61 180 top
R143  74.15,47.61 180 top
R144  70.08,47.61 180 top
R145  70.08,36.18 0 top
R146  74.15,36.18 0 top
R147  78.21,36.18 0 top
R148  82.27,36.18 0 top
R149  86.34,36.18 0 top
R150  86.08,28.3 180 top
R151  86.34,45.32 180 top
R152  82.27,45.32 180 top
R153  78.21,45.32 180 top
R154  74.15,45.32 180 top
R155  70.08,45.32 180 top
R156  70.08,38.21 0 top
R157  74.15,38.21 0 top
R158  78.21,38.21 0 top
R159  82.27,38.21 0 top
R160  86.34,38.21 0 top
R161  86.08,26.27 180 top
R162  55.86,67.78 90 top
R163  86.34,72.61 180 top
R164  82.27,72.61 180 top
R165  78.21,72.61 180 top
R166  74.15,72.61 180 top
R167  70.08,72.61 180 top
R168  70.08,61.18 0 top
R169  74.15,61.18 0 top
R170  78.21,61.18 0 top
R171  82.27,61.18 0 top
R172  86.34,61.18 0 top
R173  86.08,53.3 180 top
R174  86.34,70.32 180 top
R175  82.27,70.32 180 top
R176  78.21,70.32 180 top
R177  74.15,70.32 180 top
R178  70.08,70.32 180 top
R179  70.08,63.21 0 top
R180  74.15,63.21 0 top
R181  78.21,63.21 0 top
R182  82.27,63.21 0 top
R183  86.34,63.21 0 top
R184  86.08,51.27 180 top
R185  55.86,92.78 90 top
R186  86.34,97.61 180 top
R187  82.27,97.61 180 top
R188  78.21,97.61 180 top
R189  74.15,97.61 180 top
R190  70.08,97.61 180 top
R191  70.08,86.18 0 top
R192  74.15,86.18 0 top
R193  78.21,86.18 0 top
R194  82.27,86.18 0 top
R195  86.34,86.18 0 top
R196  86.08,78.3 180 top
R197  86.34,95.32 180 top
R198  82.27,95.32 180 top
R199  78.21,95.32 180 top
R200  74.15,95.32 180 top
R201  70.08,95.32 180 top
R202  70.08,88.21 0 top
R203  74.15,88.21 0 top
R204  78.21,88.21 0 top
R205  82.27,88.21 0 top
R206  86.34,88.21 0 top
R207  86.08,76.27 180 top
X1  43.69,18.8 90 top
X2  43.69,5.33 90 top
X5  43.69,43.8 90 top
X6  43.69,30.33 90 top
X7  43.69,68.8 90 top
X8  43.69,55.33 90 top
X9  92.69,18.8 90 top
X10  92.69,5.33 90 top
X11  43.69,93.8 90 top
X12  43.69,80.33 90 top
X13  92.69,43.8 90 top
X14  92.69,30.33 90 top
X15  92.69,68.8 90 top
X16  92.69,55.33 90 top
X17  92.69,93.8 90 top
X18  92.69,80.33 90 top

### Tracks (layer width: path | path; a pad name or v marks a point on that pad's centre or on a via)
5VDC  (7 unrouted)
  Top 0.61: JP1.1 JP1.2 6.79,14.48 C1.2 R1.1 | JP7.1 JP7.2 6.79,39.48 C5.2 R46.1 | JP10.1 JP10.2 6.79,64.48 C7.2 R70.1 | JP16.1 JP16.2 6.79,89.48 C11.2 R116.1 | JP13.1 JP13.2 55.79,14.48 C9.2 R93.1 | JP19.1 JP19.2 55.79,39.48 C13.2 R139.1 | JP22.1 JP22.2 55.79,64.48 C15.2 R162.1 | JP25.1 JP25.2 55.79,89.48 C17.2 R185.1
GND  (via drill 0.35)  (70 unrouted)
  Top 0.508: JP2.2 9.16,22.59 LED1.C | JP1.5 JP1.4 | R53.1 R15.1 42.16,1.27 X2.1 | JP8.2 9.16,47.59 LED3.C | JP7.5 JP7.4 | R58.1 R69.1 42.16,26.27 X6.1 | JP11.2 9.16,72.59 LED4.C | JP10.5 JP10.4 | R81.1 R92.1 42.16,51.27 X8.1 | JP17.2 9.16,97.59 LED6.C | JP16.5 JP16.4 | R127.1 R138.1 42.16,76.27 X12.1 | JP14.2 58.16,22.59 LED5.C | JP13.5 JP13.4 | R104.1 R115.1 91.16,1.27 X10.1 | JP20.2 58.16,47.59 LED7.C | JP19.5 JP19.4 | R150.1 R161.1 91.16,26.27 X14.1 | JP23.2 58.16,72.59 LED8.C | JP22.5 JP22.4 | R173.1 R184.1 91.16,51.27 X16.1 | JP26.2 58.16,97.59 LED9.C | JP25.5 JP25.4 | R196.1 R207.1 91.16,76.27 X18.1
  Top 0.61: C2.1 6.16,2.54 JP3.2 | C1.1 8.19,11.18 v8.38,11.18 | C6.1 6.16,27.54 JP9.2 | C5.1 8.19,36.18 v8.38,36.18 | C8.1 6.16,52.54 JP12.2 | C7.1 8.19,61.18 v8.38,61.18 | C12.1 6.16,77.54 JP18.2 | C11.1 8.19,86.18 v8.38,86.18 | C10.1 55.16,2.54 JP15.2 | C9.1 57.19,11.18 v57.38,11.18 | C14.1 55.16,27.54 JP21.2 | C13.1 57.19,36.18 v57.38,36.18 | C16.1 55.16,52.54 JP24.2 | C15.1 57.19,61.18 v57.38,61.18 | C18.1 55.16,77.54 JP27.2 | C17.1 57.19,86.18 v57.38,86.18
  Bottom 0.508: X2.1 42.16,1.27 12.95,1.27 11.68,2.54 JP3.2 | X6.1 42.16,26.27 12.95,26.27 11.68,27.54 JP9.2 | X8.1 42.16,51.27 12.95,51.27 11.68,52.54 JP12.2 | X12.1 42.16,76.27 12.95,76.27 11.68,77.54 JP18.2 | X10.1 91.16,1.27 61.95,1.27 60.68,2.54 JP15.2 | X14.1 91.16,26.27 61.95,26.27 60.68,27.54 JP21.2 | X16.1 91.16,51.27 61.95,51.27 60.68,52.54 JP24.2 | X18.1 91.16,76.27 61.95,76.27 60.68,77.54 JP27.2
  other vias: 9.91,14.48 10.41,12.45 4.32,19.05 1.27,5.08 9.91,39.48 10.41,37.45 4.32,44.05 1.27,30.08 9.91,64.48 10.41,62.45 4.32,69.05 1.27,55.08 9.91,89.48 10.41,87.45 4.32,94.05 1.27,80.08 58.91,14.48 59.41,12.45 53.32,19.05 50.27,5.08 58.91,39.48 59.41,37.45 53.32,44.05 50.27,30.08 58.91,64.48 59.41,62.45 53.32,69.05 50.27,55.08 58.91,89.48 59.41,87.45 53.32,94.05 50.27,80.08
  pour Top (no thermals): -0.25,24.13 11.68,24.13 11.68,-0.25 -0.25,-0.25
  pour Bottom (no thermals): 11.18,24.13 11.68,24.13 11.68,-0.25 -0.25,-0.25 -0.25,24.13 10.16,24.13
  pour Top (no thermals): -0.25,49.13 11.68,49.13 11.68,24.75 -0.25,24.75
  pour Bottom (no thermals): 11.18,49.13 11.68,49.13 11.68,24.75 -0.25,24.75 -0.25,49.13 10.16,49.13
  pour Top (no thermals): -0.25,74.13 11.68,74.13 11.68,49.75 -0.25,49.75
  pour Bottom (no thermals): 11.18,74.13 11.68,74.13 11.68,49.75 -0.25,49.75 -0.25,74.13 10.16,74.13
  pour Top (no thermals): -0.25,99.13 11.68,99.13 11.68,74.75 -0.25,74.75
  pour Bottom (no thermals): 11.18,99.13 11.68,99.13 11.68,74.75 -0.25,74.75 -0.25,99.13 10.16,99.13
  pour Top (no thermals): 48.75,24.13 60.68,24.13 60.68,-0.25 48.75,-0.25
  pour Bottom (no thermals): 60.18,24.13 60.68,24.13 60.68,-0.25 48.75,-0.25 48.75,24.13 59.16,24.13
  pour Top (no thermals): 48.75,49.13 60.68,49.13 60.68,24.75 48.75,24.75
  pour Bottom (no thermals): 60.18,49.13 60.68,49.13 60.68,24.75 48.75,24.75 48.75,49.13 59.16,49.13
  pour Top (no thermals): 48.75,74.13 60.68,74.13 60.68,49.75 48.75,49.75
  pour Bottom (no thermals): 60.18,74.13 60.68,74.13 60.68,49.75 48.75,49.75 48.75,74.13 59.16,74.13
  pour Top (no thermals): 48.75,99.13 60.68,99.13 60.68,74.75 48.75,74.75
  pour Bottom (no thermals): 60.18,99.13 60.68,99.13 60.68,74.75 48.75,74.75 48.75,99.13 59.16,99.13
HV+  (7 unrouted)
  Top 0.508: R2.1 R3.1 42.37,22.61 X1.2 | R59.1 R47.1 42.37,47.61 X5.2 | R82.1 R71.1 42.37,72.61 X7.2 | R128.1 R117.1 42.37,97.61 X11.2 | R105.1 R94.1 91.37,22.61 X9.2 | R151.1 R140.1 91.37,47.61 X13.2 | R174.1 R163.1 91.37,72.61 X15.2 | R197.1 R186.1 91.37,97.61 X17.2
N$1
  Top 0.508: R4.1 R2.2
N$2
  Top 0.508: R5.1 R4.2
N$3
  Top 0.508: R6.1 R5.2
N$4
  Top 0.508: R7.1 R6.2
N$5
  Top 0.508: LED1.A R1.2
N$7
  Top 0.508: R7.2 R9.1
N$8
  Top 0.508: R3.2 R8.1
N$9
  Top 0.508: R8.2 R13.1
N$10
  Top 0.508: R10.1 R9.2
N$11
  Top 0.508: R10.2 R11.1
N$12
  Top 0.508: R11.2 R12.1
N$13
  Top 0.508: R14.1 R12.2
N$14
  Top 0.508: R13.2 R18.1
N$15
  Top 0.508: 6.1,8.38 12.45,8.38 17.53,3.3 R53.2 | R15.2 R53.2 | R14.2 R45.2 37.9,10.79 37.9,10.07 36.13,8.3 R53.2
  Top 0.61: C2.2 6.1,8.38 6.1,9.84 4,11.94 JP1.3
N$19
  Top 0.508: R18.2 R23.1
N$24
  Top 0.508: R23.2 19.3,22.61 18.54,21.84 18.54,11.92 19.29,11.18 R28.1
N$29
  Top 0.508: R33.1 R28.2
N$34
  Top 0.508: R33.2 R38.1
N$39
  Top 0.508: R38.2 R43.1
N$40
  Top 0.508: LED3.A R46.2
N$41
  Top 0.508: R43.2 R45.1
N$42
  Top 0.508: R47.2 R48.1
N$43
  Top 0.508: R48.2 R49.1
N$44
  Top 0.508: R49.2 R50.1
N$45
  Top 0.508: R50.2 R51.1
N$46
  Top 0.508: R51.2 19.3,47.61 18.54,46.84 18.54,36.92 19.29,36.18 R52.1
N$47
  Top 0.508: R54.1 R52.2
N$48
  Top 0.508: R54.2 R55.1
N$49
  Top 0.508: R55.2 R56.1
N$50
  Top 0.508: R56.2 R57.1
N$51
  Top 0.508: R60.1 R59.2
N$52
  Top 0.508: R61.1 R60.2
N$53
  Top 0.508: R62.1 R61.2
N$54
  Top 0.508: R63.1 R62.2
N$55
  Top 0.508: R63.2 R64.1
N$56
  Top 0.508: R65.1 R64.2
N$57
  Top 0.508: R65.2 R66.1
N$58
  Top 0.508: R66.2 R67.1
N$59
  Top 0.508: R68.1 R67.2
N$60
  Top 0.508: 6.1,33.38 12.45,33.38 17.53,28.3 R58.2 | R69.2 R58.2 | R68.2 R57.2 37.9,35.79 37.9,35.07 36.13,33.3 R58.2
  Top 0.61: C6.2 6.1,33.38 6.1,34.84 4,36.94 JP7.3
N$61
  Top 0.508: LED4.A R70.2
N$62
  Top 0.508: R71.2 R72.1
N$63
  Top 0.508: R72.2 R73.1
N$64
  Top 0.508: R73.2 R74.1
N$65
  Top 0.508: R74.2 R75.1
N$66
  Top 0.508: R75.2 19.3,72.61 18.54,71.84 18.54,61.92 19.29,61.18 R76.1
N$67
  Top 0.508: R77.1 R76.2
N$68
  Top 0.508: R77.2 R78.1
N$69
  Top 0.508: R78.2 R79.1
N$70
  Top 0.508: R79.2 R80.1
N$71
  Top 0.508: R83.1 R82.2
N$72
  Top 0.508: R84.1 R83.2
N$73
  Top 0.508: R85.1 R84.2
N$74
  Top 0.508: R86.1 R85.2
N$75
  Top 0.508: R86.2 R87.1
N$76
  Top 0.508: R88.1 R87.2
N$77
  Top 0.508: R88.2 R89.1
N$78
  Top 0.508: R89.2 R90.1
N$79
  Top 0.508: R91.1 R90.2
N$80
  Top 0.508: 6.1,58.38 12.45,58.38 17.53,53.3 R81.2 | R92.2 R81.2 | R91.2 R80.2 37.9,60.79 37.9,60.07 36.13,58.3 R81.2
  Top 0.61: C8.2 6.1,58.38 6.1,59.84 4,61.94 JP10.3
N$81
  Top 0.508: LED5.A R93.2
N$82
  Top 0.508: R94.2 R95.1
N$83
  Top 0.508: R95.2 R96.1
N$84
  Top 0.508: R96.2 R97.1
N$85
  Top 0.508: R97.2 R98.1
N$86
  Top 0.508: R98.2 68.3,22.61 67.54,21.84 67.54,11.92 68.29,11.18 R99.1
N$87
  Top 0.508: R100.1 R99.2
N$88
  Top 0.508: R100.2 R101.1
N$89
  Top 0.508: R101.2 R102.1
N$90
  Top 0.508: R102.2 R103.1
N$91
  Top 0.508: R106.1 R105.2
N$92
  Top 0.508: R107.1 R106.2
N$93
  Top 0.508: R108.1 R107.2
N$94
  Top 0.508: R109.1 R108.2
N$95
  Top 0.508: R109.2 R110.1
N$96
  Top 0.508: R111.1 R110.2
N$97
  Top 0.508: R111.2 R112.1
N$98
  Top 0.508: R112.2 R113.1
N$99
  Top 0.508: R114.1 R113.2
N$100
  Top 0.508: 55.1,8.38 61.45,8.38 66.53,3.3 R104.2 | R115.2 R104.2 | R114.2 R103.2 86.9,10.79 86.9,10.07 85.13,8.3 R104.2
  Top 0.61: C10.2 55.1,8.38 55.1,9.84 53,11.94 JP13.3
N$101
  Top 0.508: LED6.A R116.2
N$102
  Top 0.508: R117.2 R118.1
N$103
  Top 0.508: R118.2 R119.1
N$104
  Top 0.508: R119.2 R120.1
N$105
  Top 0.508: R120.2 R121.1
N$106
  Top 0.508: R121.2 19.3,97.61 18.54,96.84 18.54,86.92 19.29,86.18 R122.1
N$107
  Top 0.508: R123.1 R122.2
N$108
  Top 0.508: R123.2 R124.1
N$109
  Top 0.508: R124.2 R125.1
N$110
  Top 0.508: R125.2 R126.1
N$111
  Top 0.508: R129.1 R128.2
N$112
  Top 0.508: R130.1 R129.2
N$113
  Top 0.508: R131.1 R130.2
N$114
  Top 0.508: R132.1 R131.2
N$115
  Top 0.508: R132.2 R133.1
N$116
  Top 0.508: R134.1 R133.2
N$117
  Top 0.508: R134.2 R135.1
N$118
  Top 0.508: R135.2 R136.1
N$119
  Top 0.508: R137.1 R136.2
N$120
  Top 0.508: 6.1,83.38 12.45,83.38 17.53,78.3 R127.2 | R138.2 R127.2 | R137.2 R126.2 37.9,85.79 37.9,85.07 36.13,83.3 R127.2
  Top 0.61: C12.2 6.1,83.38 6.1,84.84 4,86.94 JP16.3
N$121
  Top 0.508: LED7.A R139.2
N$122
  Top 0.508: R140.2 R141.1
N$123
  Top 0.508: R141.2 R142.1
N$124
  Top 0.508: R142.2 R143.1
N$125
  Top 0.508: R143.2 R144.1
N$126
  Top 0.508: R144.2 68.3,47.61 67.54,46.84 67.54,36.92 68.29,36.18 R145.1
N$127
  Top 0.508: R146.1 R145.2
N$128
  Top 0.508: R146.2 R147.1
N$129
  Top 0.508: R147.2 R148.1
N$130
  Top 0.508: R148.2 R149.1
N$131
  Top 0.508: R152.1 R151.2
N$132
  Top 0.508: R153.1 R152.2
N$133
  Top 0.508: R154.1 R153.2
N$134
  Top 0.508: R155.1 R154.2
N$135
  Top 0.508: R155.2 R156.1
N$136
  Top 0.508: R157.1 R156.2
N$137
  Top 0.508: R157.2 R158.1
N$138
  Top 0.508: R158.2 R159.1
N$139
  Top 0.508: R160.1 R159.2
N$140
  Top 0.508: 55.1,33.38 61.45,33.38 66.53,28.3 R150.2 | R161.2 R150.2 | R160.2 R149.2 86.9,35.79 86.9,35.07 85.13,33.3 R150.2
  Top 0.61: C14.2 55.1,33.38 55.1,34.84 53,36.94 JP19.3
N$141
  Top 0.508: LED8.A R162.2
N$142
  Top 0.508: R163.2 R164.1
N$143
  Top 0.508: R164.2 R165.1
N$144
  Top 0.508: R165.2 R166.1
N$145
  Top 0.508: R166.2 R167.1
N$146
  Top 0.508: R167.2 68.3,72.61 67.54,71.84 67.54,61.92 68.29,61.18 R168.1
N$147
  Top 0.508: R169.1 R168.2
N$148
  Top 0.508: R169.2 R170.1
N$149
  Top 0.508: R170.2 R171.1
N$150
  Top 0.508: R171.2 R172.1
N$151
  Top 0.508: R175.1 R174.2
N$152
  Top 0.508: R176.1 R175.2
N$153
  Top 0.508: R177.1 R176.2
N$154
  Top 0.508: R178.1 R177.2
N$155
  Top 0.508: R178.2 R179.1
N$156
  Top 0.508: R180.1 R179.2
N$157
  Top 0.508: R180.2 R181.1
N$158
  Top 0.508: R181.2 R182.1
N$159
  Top 0.508: R183.1 R182.2
N$160
  Top 0.508: 55.1,58.38 61.45,58.38 66.53,53.3 R173.2 | R184.2 R173.2 | R183.2 R172.2 86.9,60.79 86.9,60.07 85.13,58.3 R173.2
  Top 0.61: C16.2 55.1,58.38 55.1,59.84 53,61.94 JP22.3
N$161
  Top 0.508: LED9.A R185.2
N$162
  Top 0.508: R186.2 R187.1
N$163
  Top 0.508: R187.2 R188.1
N$164
  Top 0.508: R188.2 R189.1
N$165
  Top 0.508: R189.2 R190.1
N$166
  Top 0.508: R190.2 68.3,97.61 67.54,96.84 67.54,86.92 68.29,86.18 R191.1
N$167
  Top 0.508: R192.1 R191.2
N$168
  Top 0.508: R192.2 R193.1
N$169
  Top 0.508: R193.2 R194.1
N$170
  Top 0.508: R194.2 R195.1
N$171
  Top 0.508: R198.1 R197.2
N$172
  Top 0.508: R199.1 R198.2
N$173
  Top 0.508: R200.1 R199.2
N$174
  Top 0.508: R201.1 R200.2
N$175
  Top 0.508: R201.2 R202.1
N$176
  Top 0.508: R203.1 R202.2
N$177
  Top 0.508: R203.2 R204.1
N$178
  Top 0.508: R204.2 R205.1
N$179
  Top 0.508: R206.1 R205.2
N$180
  Top 0.508: 55.1,83.38 61.45,83.38 66.53,78.3 R196.2 | R207.2 R196.2 | R206.2 R195.2 86.9,85.79 86.9,85.07 85.13,83.3 R196.2
  Top 0.61: C18.2 55.1,83.38 55.1,84.84 53,86.94 JP25.3

### Text on the board
tNames: HV+ | HV+ | HV- | HV- | HV+ | HV+ | HV- | HV- | HV+ | HV+ | HV- | HV- | HV+ | HV+ | HV- | HV-
bNames: HV+ | HV+ | HV- | HV- | HV+ | HV+ | HV- | HV- | HV+ | HV+ | HV- | HV- | HV+ | HV+ | HV- | HV-